# EAGLE design main (EAGLE 9.6.2)
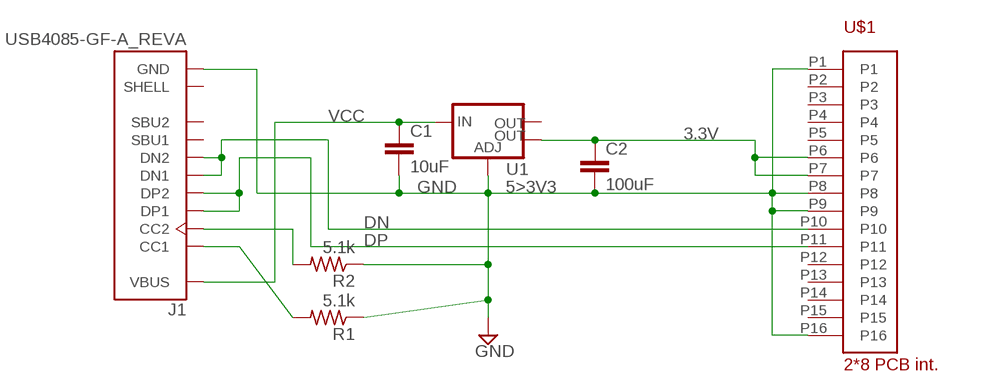
[diagram p0: schematic, sheet 1]

## Parts
C1  10uF  C-EUC0805  [C0805]
C2  100uF  C-EUC0805  [C0805]
J1  USB4085-GF-A_REVA  [GCT_USB4085-GF-A_REVA]
R1  5.1k  R-US_R0805  [R0805]
R2  5.1k  R-US_R0805  [R0805]
U1  5>3V3  V_REG_LM1117SOT223  [SOT223]
U$1  MOLEX_0541020164MOLEX  [MOLEX_0541020164]

## Nets
3.3V: C2.1 U1.4(OUT) U$1.P6 U$1.P7
DN: J1.A7(DN1) J1.B7(DN2) U$1.P10
DP: J1.A6(DP1) J1.B6(DP2) U$1.P11
GND: C1.2 C2.2 J1.A1(GND) J1.A12(GND) J1.B1(GND) J1.B12(GND) R1.1 R2.1 U1.1(ADJ) U$1.P1 U$1.P8 U$1.P9 U$1.P16
N$1: J1.B5(CC2) R2.2
N$2: J1.A5(CC1) R1.2
VCC: C1.1 J1.A4(VBUS) J1.A9(VBUS) J1.B4(VBUS) J1.B9(VBUS) U1.3(IN)
Unconnected: J1.A8(SBU1) J1.B8(SBU2) J1.P1(SHELL) J1.P2(SHELL) J1.P3(SHELL) J1.P4(SHELL) U1.2(OUT) U$1.P2 U$1.P3 U$1.P4 U$1.P5 U$1.P12 U$1.P13 U$1.P14 U$1.P15

## Library data of the parts
C1 C2 = rcl:C-EU: CAPACITOR, European symbol; SPICEPREFIX: C
J1 = USB4085-GF-A_REVA:USB4085-GF-A_REVA: USB 2.0 Type C Receptacle Dip Type, PCB Top Mount; DIGI-KEY_PART_NUMBER: 2073-USB4085-GF-ACT-ND; DIGI-KEY_PURCHASE_URL: https://www.digikey.com/product-detail/en/gct/USB4085-GF-A/2073-USB4085-GF-ACT-ND/9859733?utm_source=snapeda&utm_medium=aggregator&utm_campaign=symbol; MF: Global Connector Technology; MP: USB4085-GF-A; PACKAGE: Package Analog Devices
R1 R2 = rcl:R-US_: RESISTOR, American symbol; SPICEPREFIX: R
U1 = SparkFun-IC-Power:V_REG_LM1117: Voltage Regulator LM1117 Standard adjustable voltage regulator but in SMD form. Spark Fun Electronics SKU : COM-00595; PROD_ID: VREG-08170
U$1 = wiiBL:MOLEX_0541020164

## Module WIIBLBOARD
Ports: 

### Library data of the parts

## Board
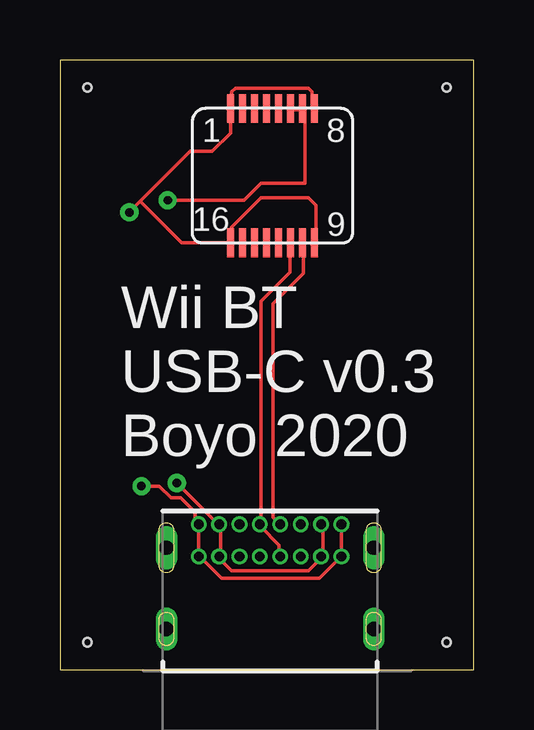
[diagram p1: board, top side]
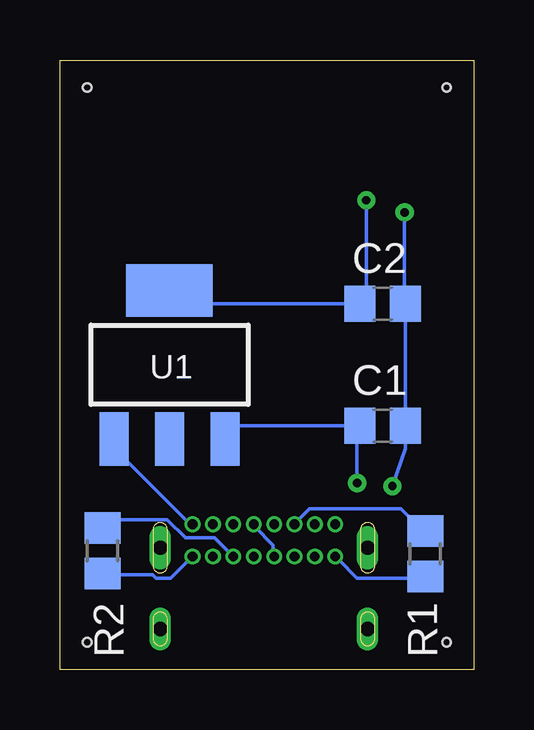
[diagram p2: board, bottom side, seen from below]

Size 17.27 x 25.4 mm. Coordinates in mm from the lower left corner, seen from the top.
Outline: 0,0 17.27,0 17.27,25.4 0,25.4 0,0
Copper layers (1*16): Top 0.035mm / dielectric 1.5mm / Bottom 0.035mm
Design rules "default *": minimum track width 6mil, minimum drill 0.35mm, track to track 6mil, track to pad 6mil, pad to pad 6mil, via to via 6mil, smd to smd 6mil, copper to edge 40mil, drill to drill 6mil, minimum pad ring 5mil, minimum via ring 8mil, stop-mask expansion 4mil, vias tented up to drill 0mil, thermal gap 10mil
Holes 0.35 mm at 1.14,24.26 1.14,1.14 16.13,1.14 16.13,24.26

### Footprints (pad centres in the part's own frame; a part is rotated, then mirrored left to right if it is on the bottom)
C0805 = smd 1.3 x 1.5: 1 -0.95,0; 2 0.95,0
GCT_USB4085-GF-A_REVA = drill 0.4 pad 0.584: A1 -2.975,4.025; A4 -2.125,4.025; A5 -1.275,4.025; A6 -0.425,4.025; A7 0.425,4.025; A8 1.275,4.025; A9 2.125,4.025; A12 2.975,4.025; B1 2.975,2.675; B4 2.125,2.675; B5 1.275,2.675; B6 0.425,2.675; B7 -0.425,2.675; B8 -1.275,2.675; B9 -2.125,2.675; B12 -2.975,2.675 | drill 0.6 long: P1 -4.325,3.045; P2 4.325,3.045; P3 4.325,-0.335; P4 -4.325,-0.335
R0805 = smd 1.3 x 1.5: 1 -0.95,0; 2 0.95,0
SOT223 = smd 1.219 x 2.235: 1 -2.311,-3.099; 2 0,-3.099; 3 2.311,-3.099 | smd 3.6 x 2.2: 4 0,3.099
MOLEX_0541020164 = smd 0.3 x 1.2: P1 -1.778,5.6; P2 -1.278,5.6; P3 -0.778,5.6; P4 -0.278,5.6; P5 0.222,5.6; P6 0.722,5.6; P7 1.222,5.6; P8 1.722,5.6; P9 1.722,0; P10 1.222,0; P11 0.722,0; P12 0.222,0; P13 -0.278,0; P14 -0.778,0; P15 -1.278,0; P16 -1.778,0

### Placement (x,y rotation side)
C1  3.81,10.16 0 bottom
C2  3.81,15.24 0 bottom
J1  8.76,2.03 0 top
R1  2.03,4.83 90 bottom
R2  15.49,4.95 90 bottom
U1  12.7,12.7 0 bottom
U$1  8.89,17.78 0 top

### Tracks (layer width: path | path; a pad name or v marks a point on that pad's centre or on a via)
3.3V  (via drill 0.35)
  Top 0.152: U$1.P6 9.75,23.32 10.06,23.32 U$1.P7 10.21,23.32 10.21,20.27 8.38,20.27 7.67,19.56 v4.5,19.56
  Bottom 0.152: v4.5,19.56 4.5,15.5 C2.1 12.14,15.24 U1.4
DN
  Top 0.152: 10.06,17.83 U$1.P10 | 10.06,17.68 U$1.P10 | 9.14,6.1 J1.A7 8.89,6.36 8.89,15.24 10.16,16.51 10.16,17.73 U$1.P10
  Bottom 0.152: J1.B7 8.38,4.72 8.38,5.18 9.14,5.94 J1.A7
DP
  Top 0.152: U$1.P11 9.6,17.68 9.6,16.56 8.38,15.34 8.38,6.1 J1.A6 8.38,5.94 9.14,5.18 9.14,4.72 J1.B6
GND  (via drill 0.35)
  Top 0.152: 10.52,17.68 U$1.P9 10.67,17.83 10.67,19.36 10.36,19.66 8.38,19.66 7.16,18.44 7.16,17.83 U$1.P16 5.08,17.78 3.35,19.51 | U$1.P1 7.16,23.47 7.16,24.08 7.32,24.23 10.36,24.23 10.52,24.08 10.52,23.47 U$1.P8 | 7.01,23.32 U$1.P1 | 11.73,4.72 11.73,5.94 J1.A12 | 11.73,4.72 J1.B1 | 11.73,4.72 10.82,3.81 6.75,3.81 5.85,4.71 J1.B12 5.79,4.72 5.79,5.94 J1.A1 5.64,6.1 5.64,6.55 5.03,7.17 4.62,7.17 4.15,7.64 v3.4,7.64 | v2.9,19.05 3.35,19.51 | 3.35,19.51 5.44,21.59 6.35,21.59 7.11,22.35 U$1.P1
  Bottom 0.152: 2.9,10.21 C1.2 | v3.4,7.64 2.86,9.2 C1.2 | v2.9,19.05 2.9,15.28 C2.2 C1.2 | U1.1 14.94,9.6 14.94,9.14 11.89,6.1 J1.A12 | R1.1 2.13,3.81 4.88,3.81 5.64,4.57 J1.B12 | R2.1 15.39,3.96 13.41,3.96 13.26,3.81 12.65,3.81 11.89,4.57 J1.B1
N$1
  Bottom 0.152: J1.B5 10.06,4.72 10.82,5.49 12.04,5.49 12.8,6.25 15.09,6.25 15.39,5.94 R2.2
N$2
  Bottom 0.152: J1.A5 7.47,6.1 6.86,6.71 3.05,6.71 2.13,5.79 R1.2
VCC  (via drill 0.35)
  Top 0.152: J1.B4 10.97,4.72 10.97,5.94 J1.A9 | J1.B4 10.82,4.57 10.36,4.12 7.16,4.12 6.71,4.57 J1.B9 6.71,4.72 6.71,5.94 J1.A4 6.55,6.1 v4.88,7.77 | 10.97,4.57 J1.B4
  Bottom 0.152: 10.52,9.6 U1.3 9.83,10.16 C1.1 4.88,10.04 v4.88,7.77 | 10.82,6.1 J1.A9

### Text on the board
tNames: Wii BT / USB-C v0.3 / Boyo 2020